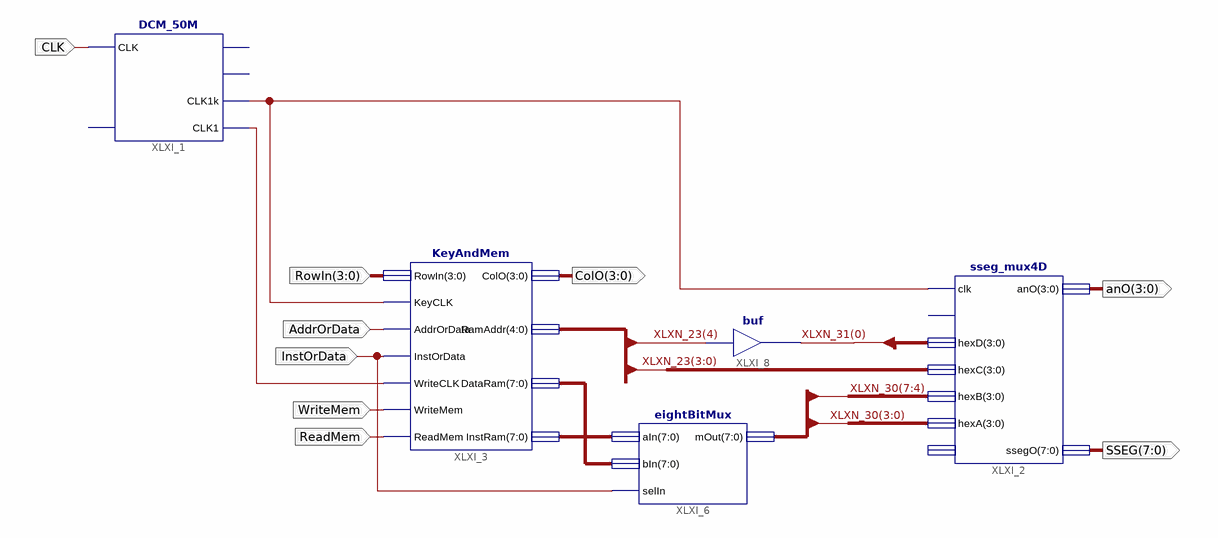
[diagram p0: schematic sheet 1]
// Xilinx ISE schematic TestArea.sch (spartan3e) as structural Verilog: 5 symbols, 9 ports
module TestArea (
  input  CLK,
  input  [3:0] RowIn,
  input  AddrOrData,
  input  InstOrData,
  input  WriteMem,
  input  ReadMem,
  output [3:0] ColO,
  output [3:0] anO,
  output [7:0] SSEG
);

  wire XLXN_21, XLXN_22;
  wire [3:0] XLXN_31;
  wire [4:0] XLXN_23;
  wire [7:0] XLXN_27, XLXN_28, XLXN_30;

  DCM_50M XLXI_1 (.CLK(CLK), .CLK1k(XLXN_21), .CLK1(XLXN_22));  // open: RST, CLK1M, CLK10k
  sseg_mux4D XLXI_2 (
    .clk(XLXN_21), .hexD(XLXN_31), .hexC(XLXN_23[3:0]), .hexB(XLXN_30[7:4]), .hexA(XLXN_30[3:0]), .anO(anO),
    .ssegO(SSEG));  // open: rb_in, dp_in
  KeyAndMem XLXI_3 (
    .RowIn(RowIn), .KeyCLK(XLXN_21), .AddrOrData(AddrOrData), .WriteCLK(XLXN_22), .WriteMem(WriteMem),
    .ReadMem(ReadMem), .InstOrData(InstOrData), .RamAddr(XLXN_23), .DataRam(XLXN_28), .InstRam(XLXN_27),
    .ColO(ColO));
  eightBitMux XLXI_6 (.aIn(XLXN_27), .bIn(XLXN_28), .selIn(InstOrData), .mOut(XLXN_30));
  buf XLXI_8 (XLXN_31[0], XLXN_23[4]);
endmodule
